# EAGLE design Mini_Arduino_5mm_RGB (EAGLE 6.5.0)
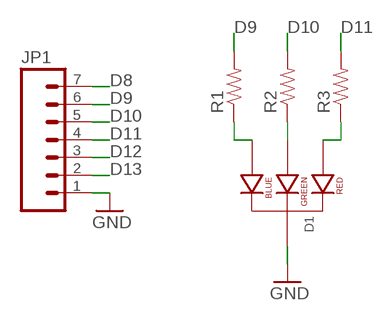
[diagram p0: schematic, sheet 1]

## Parts
D1  LED-RGB-CC-THRUDIFFUSE  [LED-RGB-THRU]
JP1  M07  [1X07]
R1  RESISTORAXIAL-0.3  [AXIAL-0.3]
R2  RESISTORAXIAL-0.3  [AXIAL-0.3]
R3  RESISTORAXIAL-0.3  [AXIAL-0.3]

## Nets
D8: JP1.7
D9: JP1.6 R1.P$2
D10: JP1.5 R2.P$2
D11: JP1.4 R3.P$2
D12: JP1.3
D13: JP1.2
GND: D1.2(CATHODE) JP1.1
N$1: D1.4(BLUE_CATHODE) R1.P$1
N$3: D1.3(GREEN_CATHODE) R2.P$1
N$5: D1.1(RED_CATHODE) R3.P$1

## Library data of the parts
D1 = barbary_enterprises:LED-RGB-CC-THRU: RGB Through-hole common cathode LED SparkFun Storefront: COM-00105 (Clear) COM-09264 (Diffuse); PROD_ID: DIO-09434
JP1 = SparkFun-Connectors:M07: Header 7 Standard 7-pin 0.1" header. Use with straight break away headers (SKU : PRT-00116), right angle break away headers (PRT-00553), swiss pins (PRT-00743), machine pins (PRT-00117), and female headers (PRT-00115). NOTES ON THE VARIANTS LOCK and LOCK_LONGPADS... This footprint was designed to help hold the alignment of a through-hole component (i.e. 7-pin header) while soldering it into place. You may notice that each hole has been shifted either up or down by 0.005 of an inch from it's more standard position (which is usually a perfectly straight line). This slight alteration caused the pins (the squares in the middle) to touch the edges of the holes. Because they are alternating, it causes a "brace" to hold the header in place. 0.005 has proven to be the perfect amount of "off-center" position when using our standard breakaway headers. Although looks a little odd when you look at the bare footprint, once you have a header in there, the alteration is very hard to notice. Also, if you push a header all the way into place, it is covered up entirely on the bottom side. This idea of altering the position of holes to aid alignment will be further integrated into the Sparkfun Library for other footprints. It can help hold any component with 3 or more connection pins.
R1-R3 = barbary_enterprises:RESISTOR: Resistor Basic schematic elements and footprints for 0603, 1206, and PTH resistors.

## Board
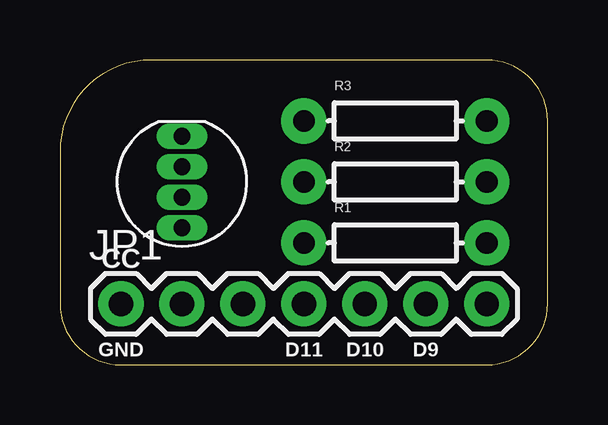
[diagram p1: board, top side]
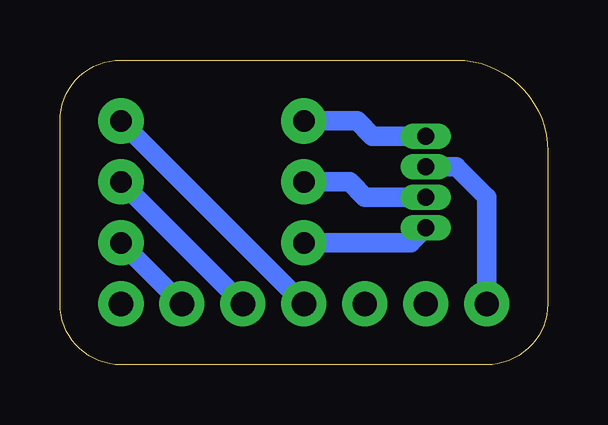
[diagram p2: board, bottom side, seen from below]

Size 20.32 x 12.7 mm. Coordinates in mm from the lower left corner, seen from the top.
Outline: 17.78,12.7 3.81,12.7 arc90 0,8.89 0,2.54 arc90 2.54,0 17.78,0 arc90 20.32,2.54 20.32,10.16 arc90 17.78,12.7
Copper layers (1*16): Top 0.0356mm / dielectric 1.5011mm / Bottom 0.0356mm
Design rules "LaenPCBOrder": minimum track width 6mil, minimum drill 13mil, track to track 6mil, track to pad 6mil, pad to pad 6mil, via to via 6mil, smd to smd 6mil, copper to edge 15mil, drill to drill 6mil, minimum pad ring 7mil, minimum via ring 7mil, stop-mask expansion 3mil, vias tented up to drill 0mil, thermal gap 10mil

### Footprints (pad centres in the part's own frame; a part is rotated, then mirrored left to right if it is on the bottom)
LED-RGB-THRU = drill 0.7 pad 0.813 long: 1 1.905,0; 2 0.635,0; 3 -0.635,0; 4 -1.905,0
1X07 = drill 1.016 pad 1.88: 1 0,0; 2 2.54,0; 3 5.08,0; 4 7.62,0; 5 10.16,0; 6 12.7,0; 7 15.24,0
AXIAL-0.3 = drill 0.9 pad 1.88: P$1 -3.81,0; P$2 3.81,0

### Placement (x,y rotation side)
D1  5.08,7.62 90 top
JP1  2.54,2.54 0 top
R1  13.97,5.08 0 top
R2  13.97,7.62 0 top
R3  13.97,10.16 0 top

### Tracks (layer width: path | path; a pad name or v marks a point on that pad's centre or on a via)
D9
  Bottom 0.813: JP1.6 R1.P$2
D10
  Bottom 0.813: JP1.5 R2.P$2
D11
  Bottom 0.813: JP1.4 R3.P$2
GND
  Bottom 0.813: D1.2 3.81,8.26 2.54,6.99 JP1.1
N$1
  Bottom 0.813: R1.P$1 5.71,5.08 D1.4
N$3
  Bottom 0.813: R2.P$1 8.26,7.62 7.62,6.99 D1.3
N$5
  Bottom 0.813: R3.P$1 7.94,10.16 7.3,9.53 D1.1

### Text on the board
tPlace: CC | GND | D11 | D10 | D9